# EAGLE design rev0 (EAGLE 9.2.2)
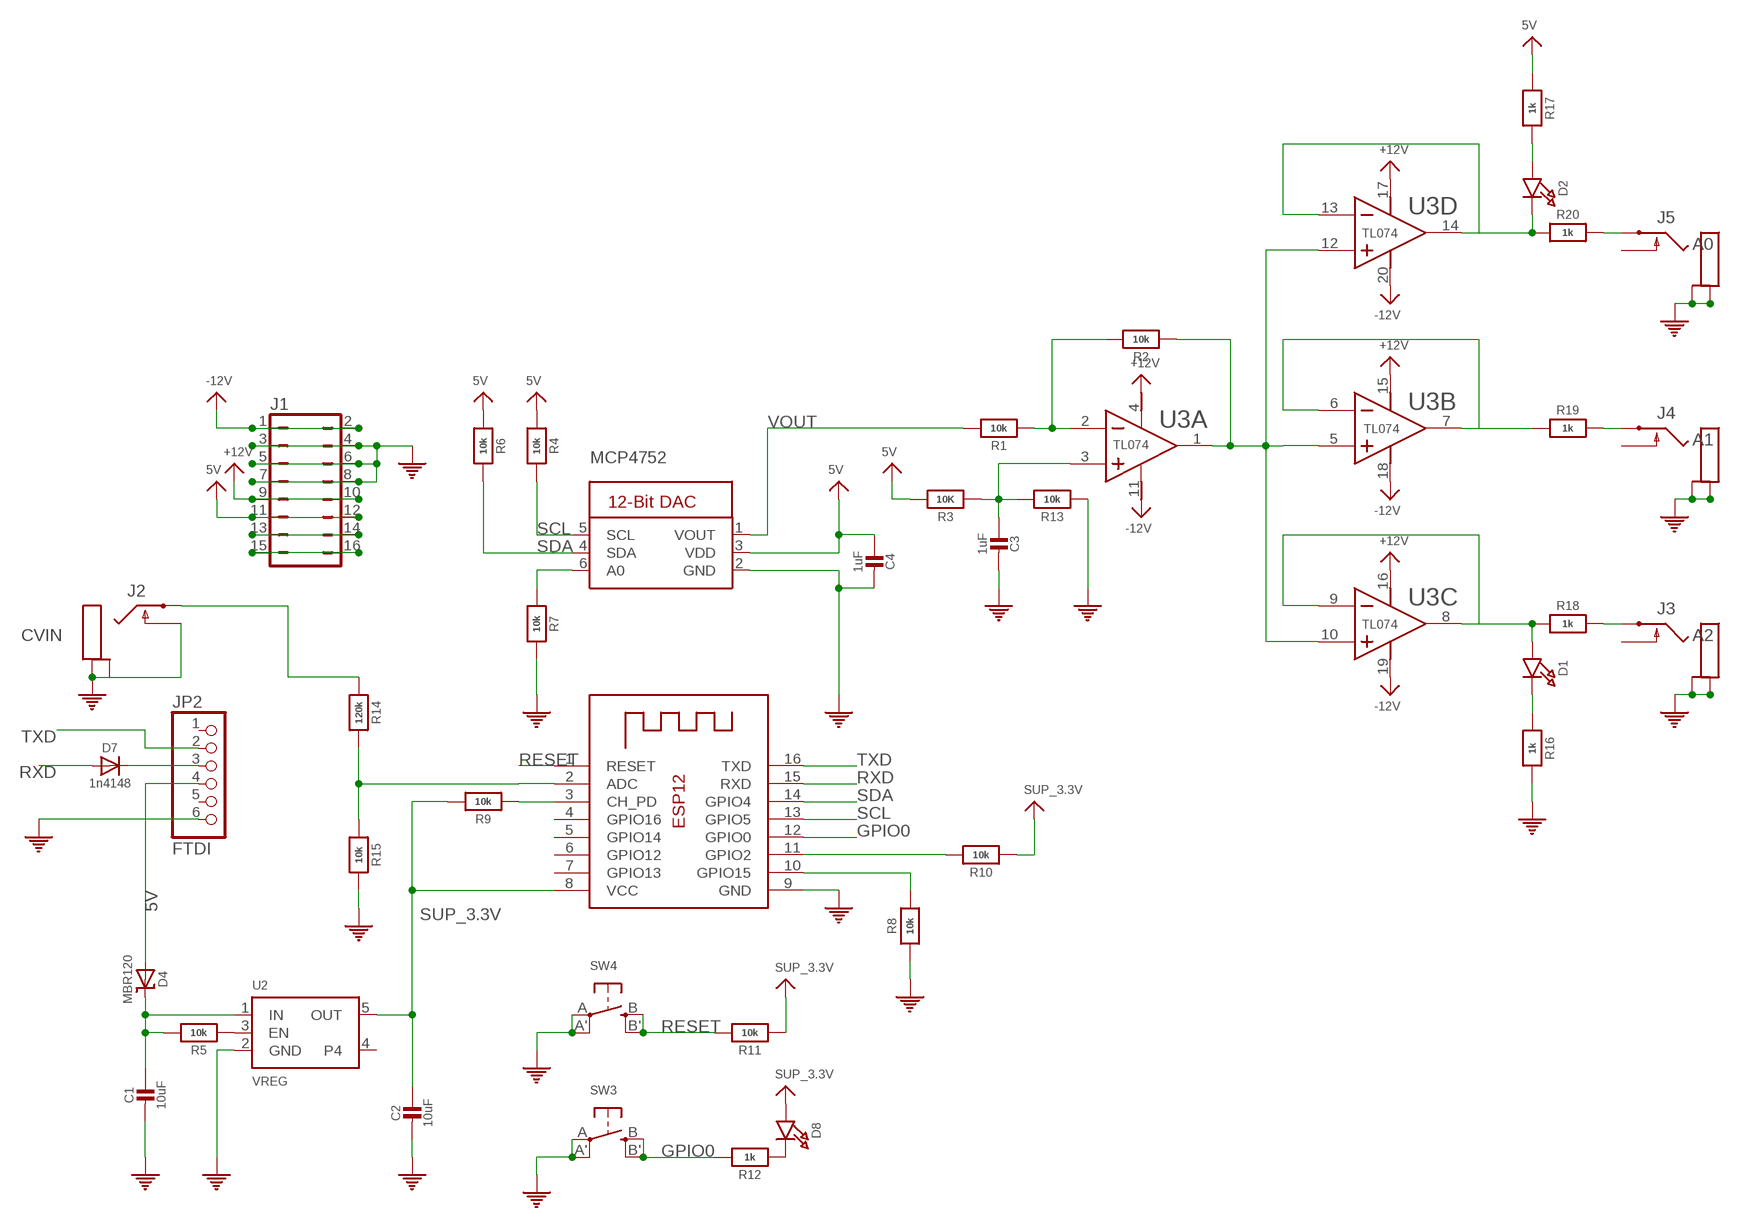
[diagram p0: schematic, sheet 1]

## Parts
C1  10uF  CAP_CERAMIC0805-NOOUTLINE  [0805-NO]
C2  10uF  CAP_CERAMIC0805-NOOUTLINE  [0805-NO]
C3  1uF  CAP_CERAMIC_0805  [0805]
C4  1uF  CAP_CERAMIC_0805  [0805]
D1  LED0805_NOOUTLINE  [CHIPLED_0805_NOOUTLINE]
D2  LED0805_NOOUTLINE  [CHIPLED_0805_NOOUTLINE]
D4  MBR120  DIODE-SCHOTTKYSOD-123  [SOD-123]
D7  1n4148  DIODESOD-323  [SOD-323]
D8  LED0805_NOOUTLINE  [CHIPLED_0805_NOOUTLINE]
J1  JMP/16P/DIPDIP  [JMP/16P/DIP]
J2  1/8"JACK/MONO/SWITCHED  [1/8"JACK/MONO/ERTHENVAR]
J3  1/8"JACK/MONO/SWITCHED  [1/8"JACK/MONO/ERTHENVAR]
J4  1/8"JACK/MONO/SWITCHED  [1/8"JACK/MONO/ERTHENVAR]
J5  1/8"JACK/MONO/SWITCHED  [1/8"JACK/MONO/ERTHENVAR]
JP2  FTDI  HEADER-1X670MIL  [1X06_ROUND_70]
MCP4752  DAC_MCP4725  [SOT23-6]
R1  10k  RESISTOR0805_NOOUTLINE  [0805-NO]
R2  10k  RESISTOR0805_NOOUTLINE  [0805-NO]
R3  10K  RESISTOR0805_NOOUTLINE  [0805-NO]
R4  10k  RESISTOR0805_NOOUTLINE  [0805-NO]
R5  10k  RESISTOR0805_NOOUTLINE  [0805-NO]
R6  10k  RESISTOR0805_NOOUTLINE  [0805-NO]
R7  10k  RESISTOR0805_NOOUTLINE  [0805-NO]
R8  10k  RESISTOR0805_NOOUTLINE  [0805-NO]
R9  10k  RESISTOR0805_NOOUTLINE  [0805-NO]
R10  10k  RESISTOR0805_NOOUTLINE  [0805-NO]
R11  10k  RESISTOR0805_NOOUTLINE  [0805-NO]
R12  1k  RESISTOR0805_NOOUTLINE  [0805-NO]
R13  10k  RESISTOR0805_NOOUTLINE  [0805-NO]
R14  120k  RESISTOR0805_NOOUTLINE  [0805-NO]
R15  10k  RESISTOR0805_NOOUTLINE  [0805-NO]
R16  1k  RESISTOR0805_NOOUTLINE  [0805-NO]
R17  1k  RESISTOR0805_NOOUTLINE  [0805-NO]
R18  1k  RESISTOR0805_NOOUTLINE  [0805-NO]
R19  1k  RESISTOR0805_NOOUTLINE  [0805-NO]
R20  1k  RESISTOR0805_NOOUTLINE  [0805-NO]
SW3  SWITCH_TACT_SMT4.6X2.8  [BTN_KMR2_4.6X2.8]
SW4  SWITCH_TACT_SMT4.6X2.8  [BTN_KMR2_4.6X2.8]
U2  VREG  VREG_SOT23-5  [SOT23-5]
U3  TEXAS_INSTRUMENTS_TL074CDRTEXAS_INSTRUMENTS_TL074CDR_0_0  [TEXAS_INSTRUMENTS_TL074CDR_0]
X1  ESP-12  [ESP-12]

## Nets
5V: C4.1 D4.A J1.11 J1.12 JP2.4 MCP4752.3(VDD) R3.2 R4.1 R6.1 R17.1
+12V: J1.9 J1.10 U3.4(A:VCC+) U3.15(B:VCC+) U3.16(C:VCC+) U3.17(D:VCC+)
-12V: J1.1 J1.2 U3.11(A:VCC-) U3.18(B:VCC-) U3.19(C:VCC-) U3.20(D:VCC-)
A0: D2.C R20.1 U3.13(D:IN4-) U3.14(D:OUT4)
A1: R19.1 U3.6(B:IN2-) U3.7(B:OUT2)
A2: D1.A R18.1 U3.8(C:OUT3) U3.9(C:IN3-)
CVIN: J2.P$1 R14.1
CVOUT: R2.1 U3.1(A:OUT1) U3.5(B:IN2+) U3.10(C:IN3+) U3.12(D:IN4+)
GND: C1.2 C2.2 C3.2 C4.2 J1.3 J1.4 J1.5 J1.6 J1.7 J1.8 J2.P$2 J2.P$3 J2.P$4 J3.P$3 J3.P$4 J4.P$3 J4.P$4 J5.P$3 J5.P$4 JP2.6 MCP4752.2(GND) R7.2 R8.1 R13.1 R15.2 R16.2 SW3.A'(P1) SW3.A(P) SW4.A'(P1) SW4.A(P) U2.2(GND) X1.9(GND)
GPIO0: R12.2 SW3.B'(S1) SW3.B(S) X1.12(GPIO0)
GPIO15: R8.2 X1.10(GPIO15)
I0: R14.2 R15.1 X1.2(ADC)
N$1: R1.1 R2.2 U3.2(A:IN1-)
N$2: J5.P$1 R20.2
N$3: D8.C R12.1
N$4: R5.1 U2.3(EN)
N$5: D7.C JP2.3
N$6: C1.1 D4.C R5.2 U2.1(IN)
N$7: MCP4752.6(A0) R7.1
N$8: R10.2 X1.11(GPIO2)
N$9: R9.1 X1.3(CH_PD)
N$10: J4.P$1 R19.2
N$11: J3.P$1 R18.2
N$12: C3.1 R3.1 R13.2 U3.3(A:IN1+)
N$13: D1.C R16.1
N$14: D2.A R17.2
N$40: J1.13 J1.14
N$117: J1.15 J1.16
RESET: R11.2 SW4.B'(S1) SW4.B(S) X1.1(RESET)
RXD: D7.A X1.15(RXD)
SCL: MCP4752.5(SCL) R4.2 X1.13(GPIO5)
SDA: MCP4752.4(SDA) R6.2 X1.14(GPIO4)
SUP_3.3V: C2.1 D8.A R9.2 R10.1 R11.1 U2.5(OUT) X1.8(VCC)
TXD: JP2.2 X1.16(TXD)
VOUT: MCP4752.1(VOUT) R1.2
Unconnected: J3.P$2 J4.P$2 J5.P$2 JP2.1 JP2.5 U2.4 X1.4(GPIO16) X1.5(GPIO14) X1.6(GPIO12) X1.7(GPIO13)

## Library data of the parts
C1-C4 = ddh:CAP_CERAMIC: Ceramic Capacitors For new designs, use the packages preceded by an '_' character since they are more reliable: The following footprints should be used on most boards: _0402 - Standard footprint for regular board layouts _0603 - Standard footprint for regular board layouts _0805 - Standard footprint for regular board layouts _1206 - Standard footprint for regular board layouts For extremely tight-pitch boards where space is at a premium, the following 'micro-pitch' footprints can be used (smaller pads, no silkscreen outline, etc.): _0402MP - Micro-pitch footprint for very dense/compact boards _0603MP - Micro-pitch footprint for very dense/compact boards _0805MP - Micro-pitch footprint for very dense/compact boards _1206MP - Micro-pitch footprint for very dense/compact boards
D1 D2 D8 = ddh:LED: LED 0603 - 0603 Surface Mount Package 2mA: Green LED - Low Power (3.9mcd, 2ma, 1.7Vf) - Digikey: 475-2709-2-ND Orange LED - Low Power (9.8mcd, 2ma, 1.8Vf) - Digikey: 475-1194-2-ND Red LED - Low Power (5mcd, 2ma, 1.8Vf) - Digikey: 475-1195-2-ND Yellow LED - Low Power (7mcd, 2ma, 1.8Vf) - Digikey: 475-1196-2-ND 5mA: Blue LED - Low Power (17mcd, 5ma, 2.9Vf) - Digikey: LNJ937W8CRACT-ND 0805 - 0805 Surface Mount Package 2mA: Red LED (8.8mcd, 2mA, 1.8Vf, Clear) - Low Power [Digikey: 475-2510-1-ND] Green LED (5mcd, 2mA, 1.8Vf, Clear) - Low Power [Digikey: 475-2730-1-ND] Yellow LED (11.3mcd, 2mA, 1.8Vf, Clear) - Low Power [Digikey: 475-2555-1-ND] 20mA: Red LED (104mcd, 20mA, Diffused) - LS R976 [Digikey: 475-1278-6-ND] Red LED (12mcd, 20mA, 2.0Vf, Clear) - APT2012EC [Digikey: 754-1128-1-ND] Green LED (15mcd, 20mA, 2.2Vf, Clear) - APT2012GC [Digikey: 754-1131-1-ND] Orange LED (160mcd, 20mA, 2.1Vf, Clear) - APT2012SECK [Digikey: 754-1130-1-ND] 1206 - 1206 Surface Mount Package Green LED (26mcd, 20mA, Diffused) - LG N971 [Digikey: 475-1407-6-ND] Red LED (15mcd, 20mA, Diffused) - LH N974 [Digikey: 475-1416-6-ND] Cree - Cree High-Power Surface Mount LEDs XPEBWT-L1-0000-00D50 - White 111lm 350mA 2.9Vf 6200K 110° XTEAWT-00-0000-00000LEE3 - White 114lm 350mA 2.85Vf 5000K 115° Everlight - Everlight 45-21 Series Surface Mount LEDs 45-21/QK2C-B2832AC2CB2/2T - Warm White 2000mcd 20mA 3.25Vf 3050K 120° 45-21/LK2C-B38452C4CB2/2T - Nuetral White 2000mcd 20mA 3.25Vf 4150K 120° 45-21/LK2C-B50634C6CB2/2T - Cold White 2200mcd 20mA 3.25Vf 5650K 120° PLCC2 Reverse Mount LS T77K-J1L2-1-0-2-R18-Z - Red 11.25mcd 2mA 1.8Vf 630nm 120° LO T77K-L1M2-24-Z - Orange 19.6mcd 2mA 1.8Vf 606nm 120° LY T77K-K2M1-26-Z - Yellow 15.7mcd 2mA 1.8Vf 587nm 120°
D4 = ddh:DIODE-SCHOTTKY
D7 = ddh:DIODE: Diode SMA Model Volts Amps Type Vf Ir Digikey # Notes SSA34-E3 40V 3A Schottky 480mV @ 3A 200uA @ 40V SSA34-E3/61TGITR-ND CDBA120-G 20V 1A Schottky 500mV @ 1A 500uA @ 20V 641-1014-6-ND REEL MBRA210 10V 2A Schottky 350mV @ 2A 700uA @ 10V MBRA210LT3 SOD-123 Model Volts Amps Type Vf Ir Order # Notes BAT54T1G 30V 200mA Schottky 800mV @ 200mA 2uA @ 25V BAT54T1GOSTR-ND B0530W 30V 500mA Schottky 430mV @ 500mA 130uA @ 30V B0530W-FDICT-ND REEL MBR120 20V 1A Schottky 340mV @ 1A MBR120VLSFT1GOSCT-ND SOD-323 Model Volts Amps Type Vf Ir Order # Notes PMEG2005EJ 20V 500mA Schottky 355mV @ 500mA 568-4110-1-ND ZLLS410 10V 570mA Schottky 380mV @ 570mA ZLLS410CT-ND 1N4148WS 75V 150mA Silicon/Simple 1V 1N4148WSFSCT-ND REEL SOD-523 Model Volts Amps Type Vf Ir Order # Notes BAT54XV2 30V 200mA Schottky 0.8V @ 100mA BAT54XV2CT-ND TB751S 30V 30mA Schottky RB751S-40TE61CT-ND SOT23-R/W (R = Solder Paste/Reflow Ovens, W = Hand-Soldering) Model Volts Amps Type Vf Ir Order # Notes BAT54FILM 40V 300mA Schottky 497-7162-1-ND POWERDI-5 Model Volts Amps Type Vf Ir Order # Notes PDS560 60V 5A Schottky 670mV @ 5A 150uA @ 60V PDS560DICT-ND
J1 = audioint:JMP/16P/DIP
J2-J5 = audioint:1/8"JACK/MONO/SWITCHED
JP2 = ddh:HEADER-1X6: PIN HEADER
MCP4752 = ddh:DAC_MCP4725: MCP4725 - 12-Bit I2C DAC with on-board EEPROM Settling Time: 6 µs 2.7-5.5V Supply 100kHz, 400kHz, 3.4 Mbps I²C EEPROM can be used to store a specific output voltage which will be set coming out of reset I²C Address: 1100 A2 A1 A0 A0 is set via the A0 pin, A2 and A1 are hard-wired on the chip depending on the model chosen: Part Number A2 A1 Code MCP4725A0T-E/CH 0 0 AJNN MCP4725A1T-E/CH 0 1 APNN MCP4725A2T-E/CH 1 0 AQNN MCP4725A3T-E/CH 1 1 ARNN
R1-R20 = ddh:RESISTOR: Resistors For new designs, use the packages preceded by an '_' character since they are more reliable: The following footprints should be used on most boards: _0402 - Standard footprint for regular board layouts _0603 - Standard footprint for regular board layouts _0805 - Standard footprint for regular board layouts _1206 - Standard footprint for regular board layouts For extremely tight-pitch boards where space is at a premium, the following 'micro-pitch' footprints can be used (smaller pads, no silkscreen outline, etc.): _0402MP - Micro-pitch footprint for very dense/compact boards _0603MP - Micro-pitch footprint for very dense/compact boards _0805MP - Micro-pitch footprint for very dense/compact boards _1206MP - Micro-pitch footprint for very dense/compact boards
SW3 SW4 = ddh:SWITCH_TACT_SMT: SMT Tact Switches 6x6mm - Digikey: P12940SCT-ND KMR2 (4.6x2.8mm) - Digikey: 401-1426-1-ND EVQ-PQHB55 - Light Touch, 160GF (4.5x4.5mm) - Digikey: P8090SCT-ND KMT0 - KMT021 NGJ LHS (etc.) IP68/Waterproof - Digikey: CKN10289CT-ND
U2 = ddh:VREG_SOT23-5: SOT23-5 Fixed Voltage Regulators Part Current Out V Out V In V Dropout θJA (°C/W) TJ (°C) Digikey Part No. ADP121 150mA 3.3V 3.4-5.5V 0.09V @ 150mA -- -- ADP121-AUJZ33R7CT-ND ADP121 150mA 3.0V 3.1-5.5V 0.09V @ 150mA -- -- ADP121-AUJZ30R7CT-ND ADP122 300mA 3.3V 3.4-5.5V 0.085V @ 300mA -- -- ADP122AUJZ-3.3-R7CT-ND ADP1712 300mA 3.3V 3.5-5.5V 0.17V @ 300mA -- -- ADP1712AUJZ-3.3-R7TR-ND AP7311 (Low Cost) 150mA 3.3V 3.5-6V 0.15V @ 150mA -- -- AP7311-33WG-7DICT-ND LD39015M18R 150mA 1.8V 1.9V-5.5V 0.08V @ 100mA -- -- 497-6977-1-ND LP2985A-33DBVR 150mA 3.3V 3.3-16V 0.28V @ 150mA 206 150 296-18479-1-ND MCP1824T-3302E/OT 300mA 3.3V 3.5V-6V 0.2V @ 300mA -- -- MCP1824T-3302E/OTCT-ND MIC5205-2.5YM5 TR 150mA 2.5V 2.7-16V 0.165V @ 150mA -- -- 576-1257-2-ND MIC5205-3.0YM5 TR 150mA 3.0V 3.2V-16V 0.165V @ 150mA -- -- 576-1258-2-ND MIC5205-3.3YM5 TR 150mA 3.3V 3.5V-16V 0.165V @ 150mA -- -- 576-1259-2-ND TPS780330220 150mA 3.3V+2.2V 3.6-5.5V 250mV Max -- -- 296-23332-1-ND TDA3663/N1,135 100mA 3.3V 3.5-45V 0.18V @ 50mA -- -- 568-5343-1-ND Max operating temp can be calculated using θJA, TJ (max junction temperature), and power in watts. Set the "Maximum Ambient Temperature" until it reaches TJ ("Max Junction Temperature"), which is the absolute limit for safe use of the regulator: Heat Sink Temperature Calculator <http://www.daycounter.com/Calculators/Heat-Sink-Temperature-Calculator.phtml> For example, With 12V source into a 3.3V LP2985 and a 30mA load, we are dissipating (12V-3.3V) * 0.03A = 0.261W. With a θJA of 206 °C/W, a TJ of 150°C, and 261mW we can safely use the chip without a heat sink up to 75°C (=147.1°C Junction Temperature).
U3 = ddh:TEXAS_INSTRUMENTS_TL074CDR: TI-TLXX4X_MC3403-X14; CIIVA_IDS: 19361645; CMRR_MIND_B: 70; CODE__JEDEC: MS-012; COMPONENT_LINK_1_DESCRIPTION: Manufacturer URL; COMPONENT_LINK_1_URL: http://www.ti.com/; COMPONENT_LINK_3_DESCRIPTION: Package Specification; COMPONENT_LINK_3_URL: http://www.ti.com/lit/ml/mpds177g/mpds177g.pdf; DATASHEET: http://www.ti.com/lit/ds/symlink/tl074.pdf; DATASHEET_VERSION: SLOS080J; FOOTPRINT_VARIANT_NAME_0: Level C; FOOTPRINT_VARIANT_NAME_1: Level B; FOOTPRINT_VARIANT_NAME_2: Level A; GBW_TYP_MHZ: 3; IIB_MAXP_A: 200; IMPORTED: yes; IMPORTED_FROM: vault; IMPORT_TS: 1521865914; IQ_PER_CHANNELMAXMA: 2.5; MF: Texas Instruments; MOUNTING_TECHNOLOGY: Surface Mount; MPN: TL074CDR; NUMBER_OF_CHANNELS: 4; OFFSET_DRIFTTYPUVC: 18; PACKAGE: D0014A; PACKAGE_DESCRIPTION: 14-Pin Plastic Small Outline, Body 8.65 x 3.90 mm, Pitch 1.27 mm; PACKAGE_VERSION: 4040047-5/M, 06/2011; PREFIX: U; RATING: Military; RELEASE_DATE: 1464163591; ROHS: Yes; SLEW_RATETYPVUS: 13; SUB_FAMILY: General Purpose Amplifier, High Supply Voltage Amplifier (>=30V); TOTAL_SUPPLY_VOLTAGEMAX5V_IS_5__5V_IS_10: 36; TOTAL_SUPPLY_VOLTAGEMIN5V_IS_5__5V_IS_10: 7; VAULT_GUID: 78465D15-48BC-44A8-9A07-62716B230AA7; VAULT_REVISION: 2E4C3F10-6E57-4035-9F40-9AB606D53540; VIO_25CMAXMV: 10; VN_AT_1KHZTYPNVRTHZ: 18
X1 = ddh:ESP-12

## Board
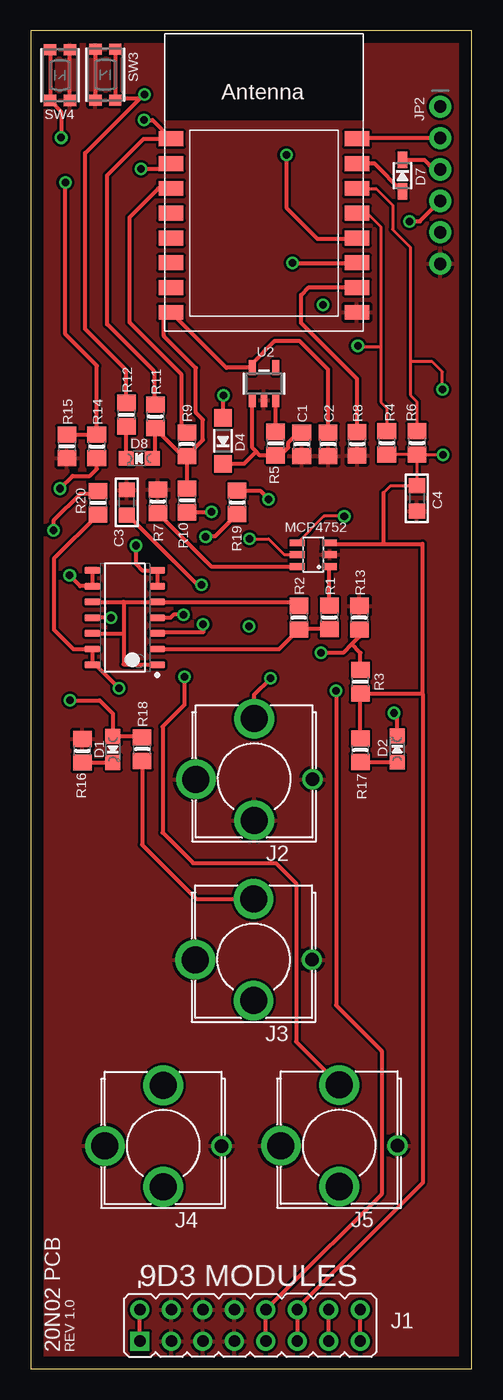
[diagram p1: board, top side]
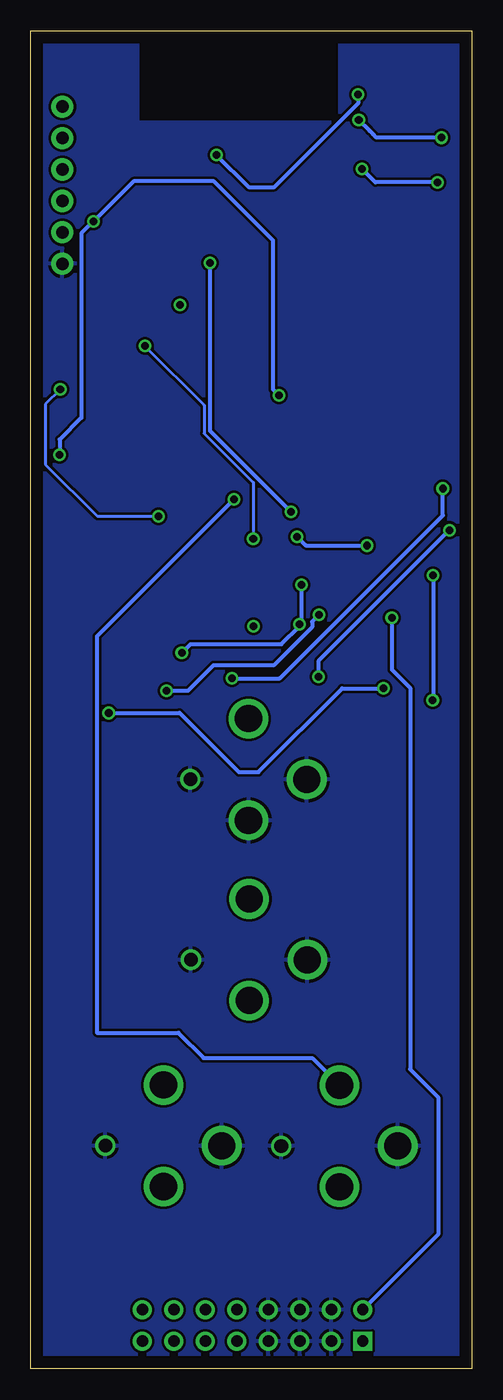
[diagram p2: board, bottom side, seen from below]

Size 35.56 x 107.95 mm. Coordinates in mm from the lower left corner, seen from the top.
Outline: 0,0 35.56,0 35.56,107.95 0,107.95 0,0
Copper layers (1*16): Top 0.035mm / dielectric 1.5mm / Bottom 0.035mm
Design rules "default": minimum track width 10mil, minimum drill 24mil, track to track 8mil, track to pad 8mil, pad to pad 8mil, via to via 8mil, smd to smd 8mil, copper to edge 40mil, drill to drill 8mil, minimum pad ring 10mil, minimum via ring 8mil, stop-mask expansion 4mil, vias tented up to drill 0mil, thermal gap 10mil

### Footprints (pad centres in the part's own frame; a part is rotated, then mirrored left to right if it is on the bottom)
0805-NO = smd 1.3 x 1.5: 1 -0.95,0; 2 0.95,0
0805 = smd 1.2 x 1.3: 1 -1.016,0; 2 1.016,0
CHIPLED_0805_NOOUTLINE = smd 1.2 x 1.2: A 0,-1.05; C 0,1.05
SOD-123 = smd 1.4 x 1.4: A 1.85,0; C -1.85,0
SOD-323 = smd 1.35 x 0.8: A 1.27,0; C -1.27,0
JMP/16P/DIP = drill 0.914 pad 1.524 square: 1 -1.27,8.89 | drill 0.914 pad 1.524: 2 1.27,8.89; 3 -1.27,6.35; 4 1.27,6.35; 5 -1.27,3.81; 6 1.27,3.81; 7 -1.27,1.27; 8 1.27,1.27; 9 -1.27,-1.27; 10 1.27,-1.27; 11 -1.27,-3.81; 12 1.27,-3.81; 13 -1.27,-6.35; 14 1.27,-6.35; 15 -1.27,-8.89; 16 1.27,-8.89
1/8"JACK/MONO/ERTHENVAR = drill 2.184: P$1 0,4.9; P$2 0,-3.3; P$4 -4.7,0 | drill 1.092: P$3 4.7,0
1X06_ROUND_70 = drill 1 pad 1.778: 1 -6.35,0; 2 -3.81,0; 3 -1.27,0; 4 1.27,0; 5 3.81,0; 6 6.35,0
SOT23-6 = smd 0.55 x 1.2: 1 -0.95,-1.3; 2 0,-1.3; 3 0.95,-1.3; 4 0.95,1.3; 5 0,1.3; 6 -0.95,1.3
BTN_KMR2_4.6X2.8 = smd 0.9 x 1: A 2.05,0.8; A' -2.05,0.8; B 2.05,-0.8; B' -2.05,-0.8
SOT23-5 = smd 0.55 x 1.2: 1 -0.95,-1.3; 2 0,-1.3; 3 0.95,-1.3; 4 0.95,1.3; 5 -0.95,1.3
TEXAS_INSTRUMENTS_TL074CDR_0 = smd 1.25 x 0.55: 1 -2.625,3.81; 2 -2.625,2.54; 3 -2.625,1.27; 4 -2.625,0; 5 -2.625,-1.27; 6 -2.625,-2.54; 7 -2.625,-3.81; 8 2.625,-3.81; 9 2.625,-2.54; 10 2.625,-1.27; 11 2.625,0; 12 2.625,1.27; 13 2.625,2.54; 14 2.625,3.81; 15 -2.625,0; 16 -2.625,0; 17 -2.625,0; 18 2.625,0; 19 2.625,0; 20 2.625,0
ESP-12 = smd 2 x 1.2: 1 -7.5,4.5; 2 -7.5,2.5; 3 -7.5,0.5; 4 -7.5,-1.5; 5 -7.5,-3.5; 6 -7.5,-5.5; 7 -7.5,-7.5; 8 -7.5,-9.5; 9 7.5,-9.5; 10 7.5,-7.5; 11 7.5,-5.5; 12 7.5,-3.5; 13 7.5,-1.5; 14 7.5,0.5; 15 7.5,2.5; 16 7.5,4.5

### Placement (x,y rotation side)
C1  21.84,74.6 270 top
C2  23.98,74.6 270 top
C3  7.72,69.9 90 top
C4  31.14,70.23 270 top
D1  6.6,49.96 180 top
D2  29.54,49.99 0 top
D4  15.49,74.88 90 top
D7  29.97,96.27 270 top
D8  8.74,73.46 90 top
J1  17.68,3.48 90 top
J2  18.01,47.55 0 top
J3  17.96,32.99 0 top
J4  10.67,17.96 0 top
J5  24.87,17.98 0 top
JP2  33.02,95.5 270 top
MCP4752  22.78,65.68 90 top
R1  24.08,60.63 90 top
R2  21.62,60.6 270 top
R3  26.57,55.42 270 top
R4  28.7,74.7 90 top
R5  19.74,74.65 270 top
R6  31.14,74.7 90 top
R7  10.24,69.98 90 top
R8  26.31,74.63 90 top
R9  12.57,74.6 270 top
R10  12.6,70.05 270 top
R11  10.03,76.83 90 top
R12  7.7,76.99 90 top
R13  26.49,60.6 270 top
R14  5.31,74.42 90 top
R15  2.9,74.42 270 top
R16  4.14,49.86 90 top
R17  26.57,49.91 270 top
R18  8.97,49.99 270 top
R19  16.64,69.9 90 top
R20  5.41,69.88 90 top
SW3  5.99,104.42 90 top
SW4  2.34,104.39 270 top
U2  18.8,79.48 0 top
U3  7.57,60.6 180 top
X1  18.8,94.74 0 top

### Tracks (layer width: path | path; a pad name or v marks a point on that pad's centre or on a via)
5V  (via drill 0.61)
  Top 0.254: 28.45,70.69 29.01,71.25 C4.1 | v33.25,73.74 31.16,73.74 R6.1 | R6.1 28.73,73.75 28.72,73.74 | R6.1 31.14,71.31
  Top 0.305: v15.54,78.54 15.49,78.49 D4.A | v30.53,92.58 31.37,92.58 JP2.4 | J1.11 J1.12 21.49,4.88 31.6,14.99 31.6,54.46 | 31.6,54.46 31.6,66.55 28.45,66.55 | 28.45,66.55 28.45,70.69 | 28.72,73.74 R4.1 | MCP4752.3 24.17,66.55 28.45,66.55 | 31.6,54.46 31.58,54.47 R3.2 R17.1 | 31.14,71.31 C4.1
  Bottom 0.305: v15.54,78.54 16.05,79.05 16.05,91.06 20.8,95.81 27.28,95.81 30.53,92.56 v30.53,92.58 31.5,91.62 31.5,76.73 33.25,74.98 v33.25,73.74
+12V  (via drill 0.61)
  Top 0.305: J1.9 J1.10 20.14,5.94 20.17,5.94 28.3,14.07 28.3,25.63 24.61,29.31 v24.61,54.71 | v12.32,60.83 11.51,60.83 11.25,60.58 10.19,60.58 U3.16
  Bottom 0.305: v12.32,60.83 12.88,60.27 12.88,59.84 15.98,56.74 20.85,56.74 22.91,54.69 24.61,54.69 v24.61,54.71
-12V  (via drill 0.61)
  Top 0.305: J1.1 J1.2 | v6.45,60.6 U3.19
  Bottom 0.305: v6.45,60.6 6.45,56.41 4.98,54.94 4.98,24.16 2.72,21.89 2.72,10.82 J1.2
A0  (via drill 0.61)
  Top 0.305: R20.1 1.85,65.37 1.85,59.64 3.43,58.06 U3.13 U3.14 5.21,56.79 v7.11,54.89 | D2.C 29.54,52.65 v29.29,52.91
  Bottom 0.305: v29.29,52.91 23.57,52.91 18.8,48.13 17.22,48.13 10.46,54.89 v7.11,54.89
A1  (via drill 0.61)
  Top 0.305: R19.1 14.84,67.16 14.12,67.16 v14.1,67.13 | v8.46,66.42 8.46,64.95 8.99,64.41 U3.7 U3.6
  Bottom 0.305: v14.1,67.13 13.39,66.42 v8.46,66.42
A2  (via drill 0.61)
  Top 0.305: v3.12,64.03 3.12,63.98 3.96,63.14 U3.9 U3.8 | v3.15,53.92 5.54,53.92 6.6,52.86 D1.A 8.89,51.01 R18.1
  Bottom 0.305: v3.12,64.03 3.12,53.95 v3.15,53.92
CVIN  (via drill 0.61)
  Top 0.305: J2.P$1 18.01,54.38 v19.33,55.7 | v2.34,71.02 3.35,72.03 4.75,72.03 5.31,72.59 R14.1
  Bottom 0.305: v19.33,55.7 15.49,55.7 2.34,68.86 v2.34,71.02 2.34,71.04
CVOUT
  Top 0.305: 7.47,61.87 U3.5 21.3,61.87 R2.1 | 7.47,61.87 7.47,59.33 | 7.47,59.33 7.47,56.82 10.19,56.82 U3.1 | U3.12 7.47,59.33 | U3.10 7.47,61.87
GND
  Top 0.305: SW4.A SW4.A' | SW3.A SW3.A'
  pour Top: 0,0 35.56,0 35.56,107.95 26.92,107.95 26.92,100.58 10.67,100.58 10.67,107.95 0,107.95
  pour Bottom: 0,107.95 10.67,107.95 10.67,100.84 26.92,100.84 26.92,107.95 35.56,107.95 35.56,0 0,0
GPIO0  (via drill 0.61)
  Top 0.305: SW3.B SW3.B' 6.96,102.54 8.81,102.54 | R12.2 7.7,80.57 4.37,83.9 4.37,98.09 8.81,102.54 | 8.81,102.54 9.17,102.89 v9.17,102.82 | v20.6,97.94 20.6,93.7 23.11,91.19 26.24,91.19 X1.12
  Bottom 0.305: v9.17,102.82 9.17,102.11 15.93,95.35 18.01,95.35 v20.6,97.94
GPIO15
  Top 0.305: R8.2 26.31,79.86 21.79,84.38 21.79,86.64 22.43,87.27 25.55,87.27 25.7,87.43 26.11,87.43 X1.10
I0  (via drill 0.61)
  Top 0.305: v8.87,96.83 10.88,96.83 X1.2 | v2.77,95.73 2.77,83.46 5.31,80.92 R14.2 R15.1
  Bottom 0.305: v2.77,95.73 7.77,95.73 v8.87,96.83
N$1
  Top 0.305: R1.1 21.64,59.68 R2.2 20.02,58.06 U3.2
N$2  (via drill 0.61)
  Top 0.305: R20.2 5.17,70.59 3.96,70.59 1.8,68.43 v1.8,67.67 | v12.37,55.83 12.37,53.57 10.62,51.82 10.62,43.26 13.08,40.79 19.76,40.79 21.39,39.17 21.39,26.36 J5.P$1
  Bottom 0.305: v1.8,67.67 12.37,57.1 v12.37,55.83
N$3
  Top 0.305: D8.C 7.69,76.03 R12.1
N$4
  Top 0.305: R5.1 19.75,75.61 U2.3
N$5
  Top 0.305: JP2.3 32.51,96.77 31.75,97.54 D7.C
N$6
  Top 0.305: 18.17,74 18.48,73.7 R5.2 20.09,73.7 20.74,74.35 20.74,74.36 20.73,74.37 20.73,74.68 21.6,75.55 C1.1 | 18.17,74 17.86,74.32 17.86,78.17 U2.1 | D4.C 17.2,73.03 18.17,74
N$7
  Top 0.305: R7.1 14.53,64.73 MCP4752.6
N$8  (via drill 0.61)
  Top 0.305: R10.2 14.62,69.1 14.66,69.14 v14.58,69.14 | v21.11,89.23 26.28,89.23 X1.11
  Bottom 0.305: v14.58,69.14 21.11,75.67 v21.11,89.23
N$9
  Top 0.305: R9.1 12.12,76.01 12.12,80.26 7.95,84.43 7.95,92.91 10.26,95.22 11.28,95.22 X1.3
N$10  (via drill 0.61)
  Top 0.305: R19.2 18.48,70.85 v19.18,70.16
  Bottom 0.305: v19.18,70.16 30.25,59.08 30.25,27.1 23.67,27.1 21.64,25.07 12.88,25.07 J4.P$1
N$11
  Top 0.305: R18.2 8.97,42.27 13.34,37.9 J3.P$1
N$12  (via drill 0.61)
  Top 0.305: v13.74,63.25 13.44,63.25 7.8,68.89 C3.1 | v13.89,60.07 13.89,59.41 10.19,59.41 U3.3 | R13.2 26.49,59.07 25.88,58.45 | 25.88,58.45 25.18,57.76 v23.39,57.76 | R3.1 26.57,57.76 25.88,58.45
  Bottom 0.305: v13.74,63.25 13.74,60.22 v13.89,60.07 13.89,59.94 15.37,58.47 22.68,58.47 v23.39,57.76
N$13
  Top 0.305: R16.1 D1.C
N$14
  Top 0.305: R17.2 29.52,48.96 D2.A
N$22  (via drill 0.61)
  other vias: 17.6,59.92
N$25  (via drill 0.61)
  other vias: 23.55,85.85
N$40
  Top 0.305: J1.13 J1.14
N$117
  Top 0.305: J1.15 J1.16
RESET  (via drill 0.61)
  Top 0.305: SW4.B' SW4.B 2.44,101.44 v2.44,99.34 | v9.12,100.76 9.8,100.76 11.3,99.27 X1.1 9.1,99.24 6.15,96.29 6.15,84.28 9.93,80.49 9.93,77.89 R11.2
  Bottom 0.305: v9.12,100.76 8.24,99.89 7.96,99.61 7.7,99.34 v2.44,99.34
RXD
  Top 0.305: D7.A 27.73,97.24 X1.15
SCL  (via drill 0.61)
  Top 0.254: 26.34,93.19 X1.13 27.13,93.24 28.22,92.15 28.22,82.42 | R4.2 28.57,75.78 28.7,75.91 28.7,77.52 28.22,78 28.22,82.42 | 28.22,82.42 26.49,82.42 v26.36,82.53 | v17.63,66.95 19.18,66.95 20.45,65.68 MCP4752.5
  Bottom 0.254: v26.36,82.53 21.59,77.75 21.59,75.47 17.63,71.5 v17.63,66.95
SDA  (via drill 0.61)
  Top 0.254: X1.14 27.85,95.24 29.18,93.9 29.18,91.92 30.61,90.5 30.61,81.25 | 30.61,81.25 30.61,78.56 31.14,78.03 R6.2 | v25.27,68.78 23.63,68.78 MCP4752.4 | v33.2,79.02 33.2,80.44 32.38,81.25 30.61,81.25
  Bottom 0.254: v33.2,79.02 34.39,77.83 34.39,72.97 30.2,68.78 v25.27,68.78
SUP_3.3V
  Top 0.305: C2.1 23.98,80.62 21.69,82.91 19.64,82.91 17.85,81.11 U2.5 15.76,80.78 X1.8 | R9.2 13.47,74.54 13.87,74.94 13.87,76.58 13.31,77.14 13.31,80.75 10.72,83.34 10.72,85.24 X1.8 | X1.8 | R9.2 12.24,73.65 10.03,75.86 R11.1 10.03,73.7 D8.A | R10.1 12.6,73.62 R9.2
TXD
  Top 0.305: JP2.2 26.37,99.31 X1.16
VOUT
  Top 0.305: R1.2 MCP4752.1

### Text on the board
tNames: 9D3 MODULES | - | 20N02 PCB | REV 1.0